# Altium schematic sheet Sheet1.SchDoc
size A4; SheetNumber: 1; SheetTotal: 1
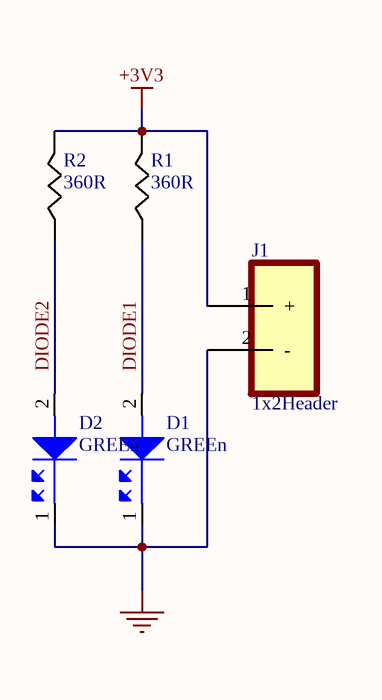
[diagram p0: Sheet1.SchDoc]

## Parts
D1  GREEn  [LEd0603G]
D2  GREEn  [LEd0603G]
J1  1x2Header  [HDR1x2]
R1  360R  [R0805]
R2  360R  [R0805]

## Nets
+3V3: J1.1(+) R1.2 R2.2
GND: D1.1 D2.1 J1.2(-)
DIODE1: D1.2 R1.1
DIODE2: D2.2 R2.1

## Library data of the parts
D1 D2 = LSM0603453V: LED GREEN CLEAR CHIP 0603 SMD; Manufacturer: Visual Communications; Optoelectronic Device Type: SINGLE COLOR LED; Supplier: Digikey; Supplier Part Number: LSM0603453VCT-ND; Manufacturer Part Number: LSM0603453V; RoHS: Yes; Category: LEDs; Stock: 27358; Pricing: 1=0.5, 10=0.291, 100=0.1218, 500=0.1086, 1000=0.1071 (USD); Reach SVHC Compliant: Yes; RoHS Compliant: Yes; ComponentLink1URL: https://datasheet.ciiva.com:443/pdfs/VipMasterIC/IC/VISU/VISU-S-A0009188582/VISU-S-A0009188582-1.pdf?src-supplier=IHS+Markit; ComponentLink1Description: https://datasheet.ciiva.com:443/pdfs/VipMasterIC/IC/VISU/VISU-S-A0009188582/VISU-S-A0009188582-1.pdf?src-supplier=IHS+Markit; ComponentLink2URL: http://www.farnell.com/datasheets/2699708.pdf?src-supplier=Farnell; ComponentLink2Description: http://www.farnell.com/datasheets/2699708.pdf?src-supplier=Farnell; ComponentLink3URL: http://www.farnell.com/datasheets/2699708.pdf?src-supplier=Newark; ComponentLink3Description: http://www.farnell.com/datasheets/2699708.pdf?src-supplier=Newark; ComponentLink4URL: https://vcclite.com/wp-content/uploads/wpallimport/files/files/LSM0603453V.pdf?src-supplier=Digikey; ComponentLink4Description: https://vcclite.com/wp-content/uploads/wpallimport/files/files/LSM0603453V.pdf?src-supplier=Digikey; Description: Single Color LED
J1 = 22-27-2021 (3): CONN HEADER VERT 2POS 2.54MMT; Manufacturer: Molex; Connector Type: BOARD CONNECTOR; Option: General Purpose; Body/Shell Style: RECEPTACLE; Contact Pattern: RECTANGULAR; Contact Resistance: 10mR; Contact Style: SQ PIN-SKT; Durability: 25Cycles; Filter Feature: No; Insulation Resistance: 1GR; Mating Information: MULTIPLE MATING PARTS AVAILABLE; Number Of Connectors: 1; Polarization Key: POLARIZED HOUSING; Rated Current (Signal): 4A; Number of Contacts: 2; Body Breadth: 0.23inch; Body Depth: 0.46inch; Body Length: 0.2inch; Mating Contact Pitch: 0.1inch; Mounting Option 1: LOCKING; Plating Thickness: 100uin; Reference Standard: UL; Reliability: COMMERCIAL; Description: Board Connector, 2 Contact(s), 1 Row(s), Male, Straight, 0.1 inch Pitch, Solder Terminal, Locking, White Insulator, Receptacle; Supplier: Digikey; Supplier Part Number: WM4111-ND; Manufacturer Part Number: 22-27-2021; RoHS: Yes; Category: Headers and Wire Housings; Stock: 49685; Pricing: 1=0.24, 10=0.208, 100=0.1766, 500=0.15764, 2850=0.1394, 5700=0.13275, 11400=0.12641 (USD); Mounting Technology: Board; Contact Material: Brass; Contact Finish - Mating: NOT SPECIFIED; Contact Finish - Termination: Bright Tin (Sn); Insulation Color: White; Insulation Material: Nylon; Min Operating Temperature: 0°C; Max Operating Temperature: 75°C; JESD-609 Code: e3; Contact Gender: Male; Mixed Contacts: No; Mounting Style: STRAIGHT; Number Of PCB Rows: 1; Number of Rows Loaded: 1; PCB Contact Pattern: RECTANGULAR; Termination: Solder; Terminal Length: 0.14inch; Terminal Pitch: 2.54mm; Flammability Rating: UL94 V-0; DIN Conformance: No; IEC Conformance: No; MIL Conformance: No; Reach SVHC Compliant: Yes; RoHS Compliant: Yes; ComponentLink1URL: https://datasheet.ciiva.com:443/pdfs/VipMasterIC/IC/MOLE/MOLE-E-A0003552261/MOLE-S-A0003534498-1.pdf?src-supplier=IHS+Markit; ComponentLink1Description: https://datasheet.ciiva.com:443/pdfs/VipMasterIC/IC/MOLE/MOLE-E-A0003552261/MOLE-S-A0003534498-1.pdf?src-supplier=IHS+Markit; ComponentLink2URL: https://datasheet.ciiva.com/15217/getdatasheetpartid-163454-15217683.pdf?src-supplier=Verical; ComponentLink2Description: https://datasheet.ciiva.com/15217/getdatasheetpartid-163454-15217683.pdf?src-supplier=Verical; ComponentLink3URL: https://datasheet.ciiva.com/9468/0022272021-pcb-headers-9468403.pdf?src-supplier=Avnet; ComponentLink3Description: https://datasheet.ciiva.com/9468/0022272021-pcb-headers-9468403.pdf?src-supplier=Avnet
R1 R2 = AC0805FR-07360RL: RES SMD 360 OHM 1% 1/8W 0805; Manufacturer: Yageo; Additional Feature: LASER TRIMMABLE; Power: 125mW; Rated Temperature: 70°C; Working Voltage: 150V; Temperature Coefficient (ppm/Cel): 100; Package Height: 0.5mm; Package Length: 2mm; Package Width: 1.25mm; Reference Standard: AEC-Q200; Description: Fixed Resistor, Metal Glaze/thick Film, 0.125W, 360ohm, 150V, 1% +/-Tol, 100ppm/Cel, Surface Mount, 0805; Supplier: Future Electronics; Supplier Part Number: 6185724; Manufacturer Part Number: AC0805FR-07360RL; RoHS: Yes; Category: Chip SMD Resistors; Stock: 5000; Pricing: 5000=0.0029, 20000=0.0028, 75000=0.0027, 150000=0.0026, 375000=0.0025 (USD); Mounting Technology: Surface Mount; Pins: 2; Package Shape: Rectangular; Case/Package: 0805; Terminal Finish: Nickel; Min Operating Temperature: -55°C; Max Operating Temperature: 155°C; Tolerance: 1%; JESD-609 Code: e3; Resistor Type: FIXED RESISTOR; Construction: Chip; Packaging: Tape and Reel; Value: 360R; Technology: METAL GLAZE/THICK FILM; Termination: Wraparound; Reach SVHC Compliant: Yes; RoHS Compliant: Yes; ComponentLink1URL: https://datasheet.ciiva.com:443/pdfs/VipMasterIC/IC/YAGO/YAGO-S-A0003597364/YAGO-S-A0003597364-1.pdf?src-supplier=IHS+Markit; ComponentLink1Description: https://datasheet.ciiva.com:443/pdfs/VipMasterIC/IC/YAGO/YAGO-S-A0003597364/YAGO-S-A0003597364-1.pdf?src-supplier=IHS+Markit; ComponentLink2URL: http://www.yageo.com/NewPortal/yageodocoutput?fileName=/pdf/R-Chip/PYu-AC_51_RoHS_L_6.pdf&src-supplier=Digikey; ComponentLink2Description: http://www.yageo.com/NewPortal/yageodocoutput?fileName=/pdf/R-Chip/PYu-AC_51_RoHS_L_6.pdf&src-supplier=Digikey; ComponentLink3URL: https://datasheet.octopart.com/AC0805FR-07360RL-Yageo-datasheet-178509465.pdf?src-supplier=Newark; ComponentLink3Description: https://datasheet.octopart.com/AC0805FR-07360RL-Yageo-datasheet-178509465.pdf?src-supplier=Newark